# Altium schematic sheet fpga_power.schdoc: FPGA Power
size 431 x 279 mm; DrawnBy: D. Bruey, M.Ciuffo; Organization: Synapse Product Development, LLC.; Address1: 1511 6th Ave., Suite 400; Address2: Seattle, Washington 98101; Address3: 206.381.0898; Address4: www.synapse.com; DocumentNumber: 4; SheetNumber: 4; SheetTotal: 10; PageSetup: Record=PageOptions|CenterHorizontal=True|CenterVertical=True|PrintScale=1.06|XCorrection=1.00|YCorrection=1.00|PrintKind=1|BorderSize=5000000|LeftOffset=0|BottomOffset=0|Orientation=2|PaperLength=4318|PaperWidth=2794|Scale=100|PaperSource=7|PrintQuality=200|MediaType=1|DitherType=10|PrintScaleMode=1|PaperKind=11x17|PaperIndex=3
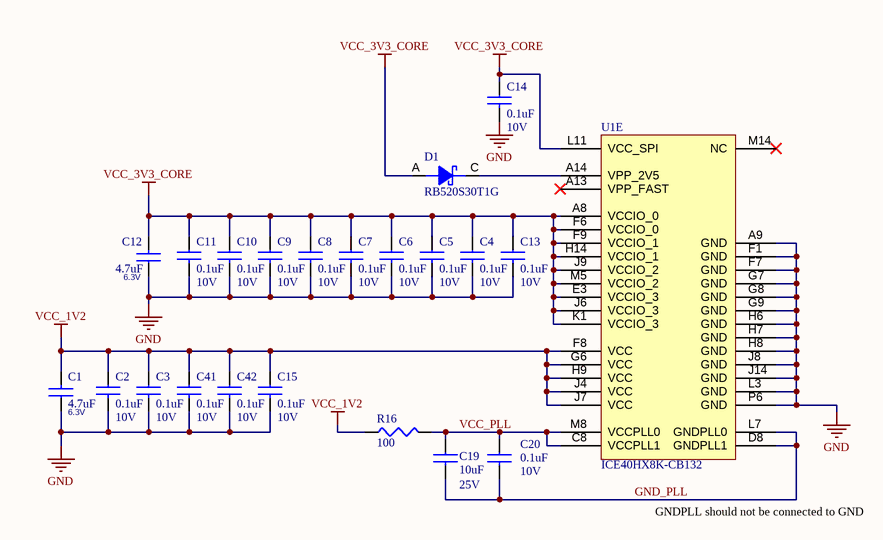
[diagram p0: fpga_power.schdoc]

## Parts
C1  4.7uF  Voltage: 6.3V  [0402-IPCsm_55]
C2  0.1uF  Voltage: 10V  [0201-IPCsm_33]
C3  0.1uF  Voltage: 10V  [0201-IPCsm_33]
C4  0.1uF  Voltage: 10V  [0201-IPCsm_33]
C5  0.1uF  Voltage: 10V  [0201-IPCsm_33]
C6  0.1uF  Voltage: 10V  [0201-IPCsm_33]
C7  0.1uF  Voltage: 10V  [0201-IPCsm_33]
C8  0.1uF  Voltage: 10V  [0201-IPCsm_33]
C9  0.1uF  Voltage: 10V  [0201-IPCsm_33]
C10  0.1uF  Voltage: 10V  [0201-IPCsm_33]
C11  0.1uF  Voltage: 10V  [0201-IPCsm_33]
C12  4.7uF  Voltage: 6.3V  [0402-IPCsm_55]
C13  0.1uF  Voltage: 10V  [0201-IPCsm_33]
C14  0.1uF  Voltage: 10V  [0201-IPCsm_33]
C15  0.1uF  Voltage: 10V  [0201-IPCsm_33]
C19  10uF  Voltage: 25V  [0603-ipcsm_90]
C20  0.1uF  Voltage: 10V  [0201-IPCsm_33]
C41  0.1uF  Voltage: 10V  [0201-IPCsm_33]
C42  0.1uF  Voltage: 10V  [0201-IPCsm_33]
D1  RB520S30T1G  [SOD523]
R16  100  [0201-IPCsm_26]
U1  ICE40HX8K-CB132  [LATC-csBGA-132]  (part E of 5)

## Nets
GND: C1.1 C2.2 C3.2 C4.2 C5.2 C6.2 C7.2 C8.2 C9.2 C10.2 C11.2 C12.1 C13.2 C14.2 C15.2 C41.2 C42.2 U1.A9(GND) U1.F1(GND) U1.F7(GND) U1.G7(GND) U1.G8(GND) U1.G9(GND) U1.H6(GND) U1.H7(GND) U1.H8(GND) U1.J8(GND) U1.J14(GND) U1.L3(GND) U1.P6(GND)
VCC_1V2: C1.2 C2.1 C3.1 C15.1 C41.1 C42.1 R16.1 U1.F8(VCC) U1.G6(VCC) U1.H9(VCC) U1.J4(VCC) U1.J7(VCC)
VCC_3V3_CORE: C4.1 C5.1 C6.1 C7.1 C8.1 C9.1 C10.1 C11.1 C12.2 C13.1 C14.1 D1.A U1.A8(VCCIO_0) U1.E3(VCCIO_3) U1.F6(VCCIO_0) U1.F9(VCCIO_1) U1.H14(VCCIO_1) U1.J6(VCCIO_3) U1.J9(VCCIO_2) U1.K1(VCCIO_3) U1.L11(VCC_SPI) U1.M5(VCCIO_2)
GND_PLL: C19.2 C20.2 U1.D8(GNDPLL1) U1.L7(GNDPLL0)
VCC_PLL: C19.1 C20.1 R16.2 U1.C8(VCCPLL1) U1.M8(VCCPLL0)
NetD1_C: D1.C U1.A14(VPP_2V5)

Not connected (* = marked no-connect by the designer): U1 A13(VPP_FAST)* M14(NC)*

## Notes on the sheet
- GNDPLL should not be connected to GND
- Design Notes:
- Layout Notes:
- Project:
- Sheet Title:
- PCBA:
- PROPRIETARY AND CONFIDENTIAL
- Drawn by:
- Schematic Part Number:
- Schematic Revision:
- Date:
- Sheet:
- /

## Library data of the parts
C1 C12 = GRM155R60J475ME47D: CAP CER 4.7UF 6.3V 20% X5R 0402; part_type: capacitor; id: 855; mfg: MURATA; dist: DIGIKEY; dist_pn: 490-5915-1-ND; symbol: \\SYNAPSEDEV.COM\DFS\FS\EE_STUFF\CAD_LIB\MASTER\MASTER_DISCRETE\CAP; allegro_footprint: 0402-IPCsm_55,c-0402_22H; source_package: C_4P7U_6.3V_X5R_0402; OrCADSymbol: MASTER_DISCRETE\CAP; TableName: viewAltiumCapacitors; mfg_pn: GRM155R60J475ME47D; type: X5R; tolerance: 20%; height: 0.55MM; status: Unknown; SymbolPath: C:\EE-Vault\Libraries\Schematic\MASTER_DISCRETE\CAP
C2-C11 C13-C15 C20 C41 C42 = CL03A104KP3NNNC: CAP CER 0.1UF 10V 10% X5R 0201; part_type: capacitor; id: 1260; mfg: Samsung Electro-Mechanics America, Inc; dist: DIGIKEY; dist_pn: 1276-1115-2-ND; source_package: C_1U_10V_X5R_0201; TableName: viewAltiumCapacitors; mfg_pn: CL03A104KP3NNNC; type: X5R; tolerance: 10%; height: 0.33mm; status: Unknown
C19 = CL10A106MA8NRNC: CAP CER 10UF 25V 20% X5R 0603; part_type: capacitor; id: 1157; mfg: Samsung Electro-Mechanics America, Inc; dist: Digikey; dist_pn: 1276-1869-1-ND; TableName: viewAltiumCapacitors; mfg_pn: CL10A106MA8NRNC; type: X5R; tolerance: 20%; height: 0.9MM; status: Unknown
D1 = RB520S30T1G: DIODE SCHOTTKY 30V 200MA SOD523; id: 1259; mfg: On Semiconductor; dist: Digikey; dist_pn: RB520S30T1GOSCT-ND; source_package: SOD-523; power: 200mW; current: 0.2A; TableName: viewAltiumDiscretes; mfg_pn: RB520S30T1G; part_type: Diode; voltage: 30V; type: SCHOTTKY; height: 0.7mm; status: Unknown
R16 = RC0201FR-07100RL: RES 100 OHM 1/20W 1% 0201 SMD; part_type: resistor; Tolerance: 1.00%; Voltage: 50V; DIST: DIGIKEY; MFG: YAGEO; DIST_PN: 311-100MCT-ND; Power: 0.05W; id: 2416; source_package: R_100_0201_1P; TableName: viewAltiumResistors; Height: 0.26MM; MFG_PN: RC0201FR-07100RL; status: Unknown; datasheet: http://www.yageo.com/documents/recent/PYu-RC_Group_51_RoHS_L_04.pdf
U1 = ICE40HX8K-CB132: IC FPGA 95 I/O 132CBGA; id: 2469; mfg: Lattice Semiconductor Corporation; dist: Digikey; dist_pn: 220-1577-ND; source_package: ICE40HX8K_CB132; voltage: 1.2-3.3v; TableName: viewAltiumIcs; mfg_pn: ICE40HX8K-CB132; part_type: ic; height: 1mm; status: Unknown